# EAGLE design T03_MotionControledLampNFET (EAGLE 7.4.0)
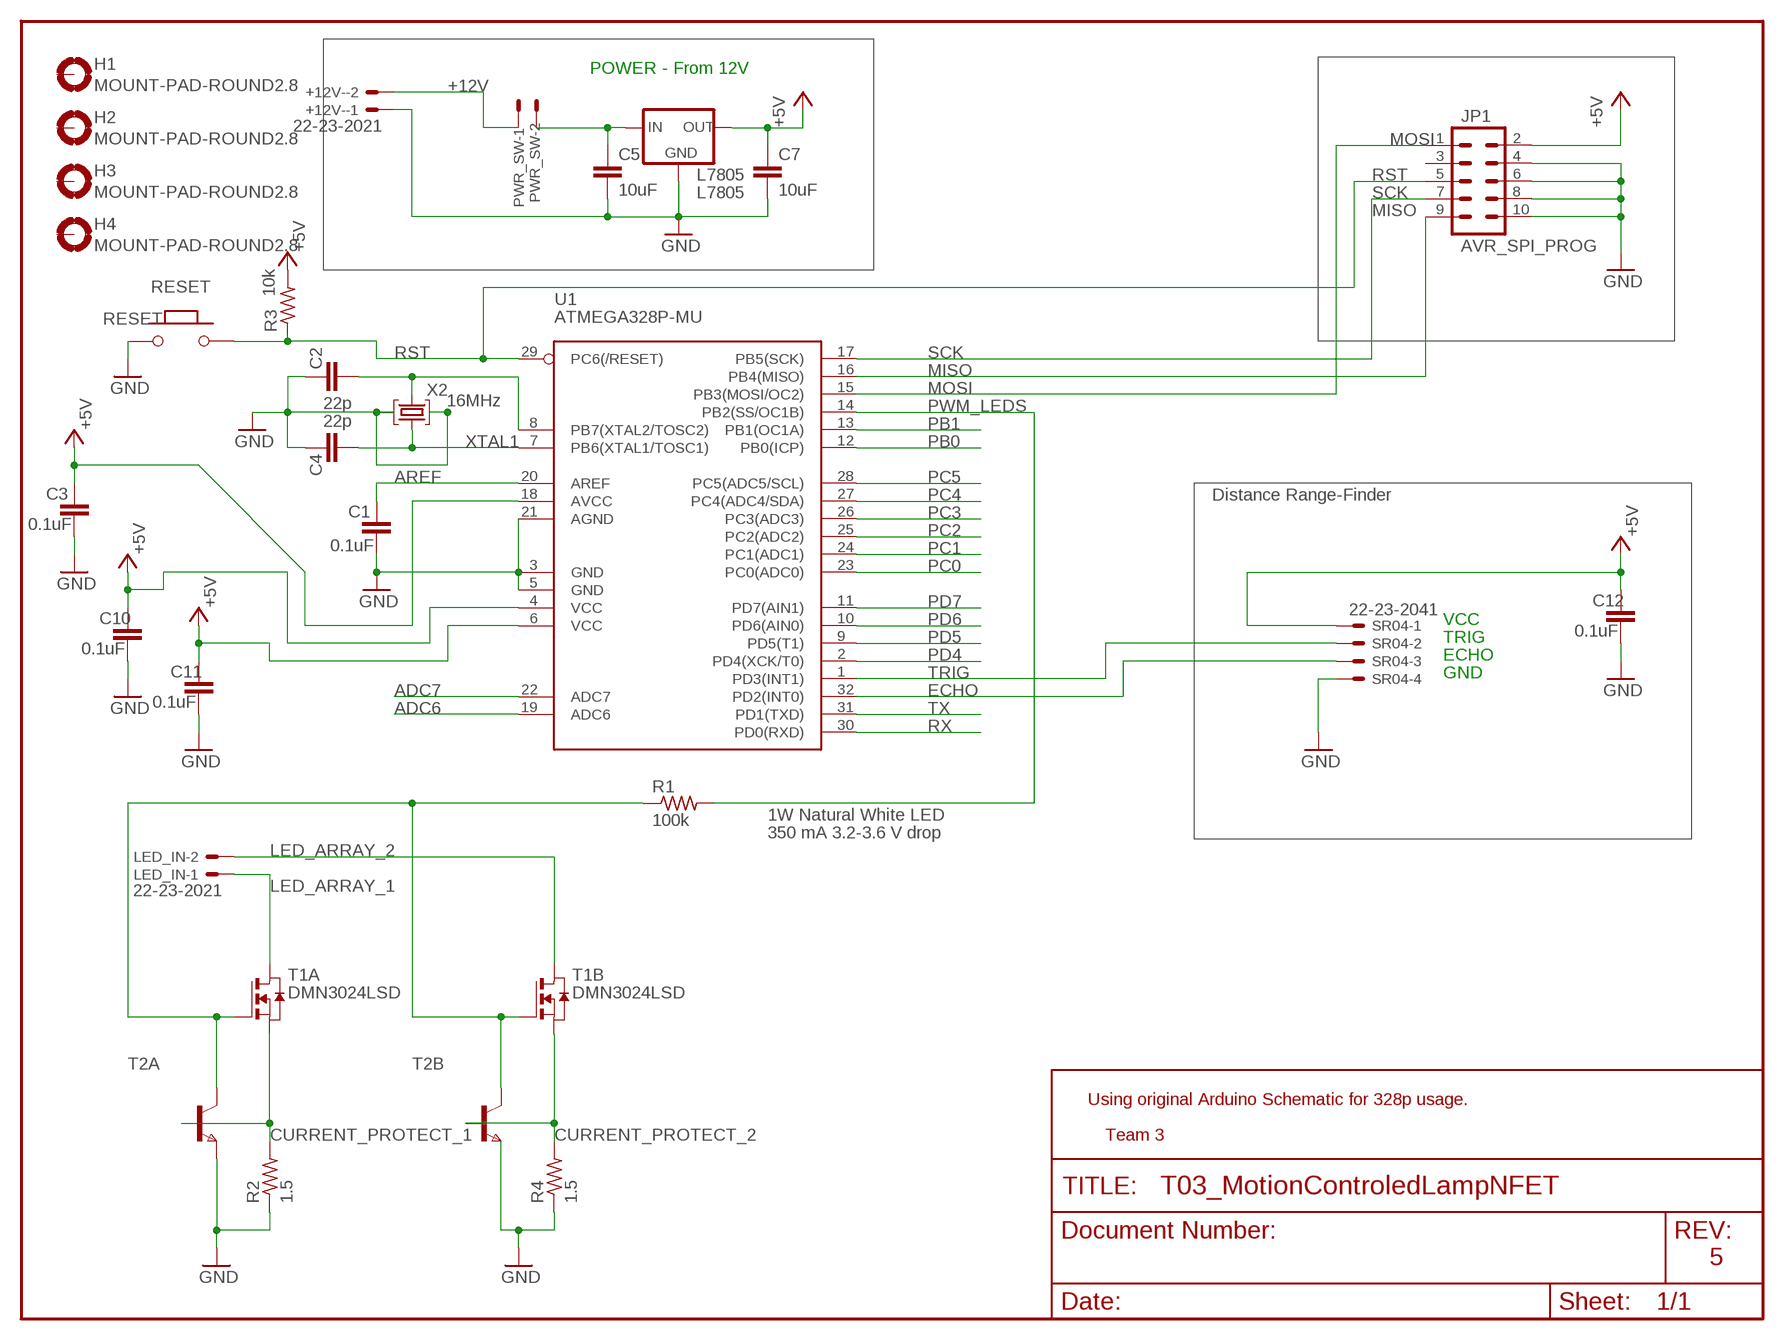
[diagram p0: schematic, sheet 1]

## Parts
+12V-  22-23-2021  [22-23-2021]
C1  0.1uF  C-EUC0603  [C0603-ROUND]
C2  22p  C-EUC0603  [C0603-ROUND]
C3  0.1uF  C-EUC0603  [C0603-ROUND]
C4  22p  C-EUC0603  [C0603-ROUND]
C5  10uF  C-EUC1206  [C1206]
C7  10uF  C-EUC1206  [C1206]
C10  0.1uF  C-EUC0603  [C0603-ROUND]
C11  0.1uF  C-EUC0603  [C0603-ROUND]
C12  0.1uF  C-EUC0603  [C0603-ROUND]
H1  MOUNT-PAD-ROUND2.8  [2,8-PAD]
H2  MOUNT-PAD-ROUND2.8  [2,8-PAD]
H3  MOUNT-PAD-ROUND2.8  [2,8-PAD]
H4  MOUNT-PAD-ROUND2.8  [2,8-PAD]
JP1  AVR_SPI_PROG  M05X2SHD_LOCK  [2X5-SHROUDED_LOCK]
L7805  L7805  78XXL  [78XXL]
LED_IN  22-23-2021  [22-23-2021]
PWR_SW  22-23-2021  [22-23-2021]
R1  100k  R-US_M1206  [M1206]
R2  1.5  R-US_M1206  [M1206]
R3  10k  R-US_M1206  [M1206]
R4  1.5  R-US_M1206  [M1206]
RESET  RESET  MYSMD_PB157  [SMD_157SW]
SR04  22-23-2041  [22-23-2041]
T1  DMN3024LSD  [SO8]
T2  NPNDUAL  [SM8]
U1  ATMEGA328P-MU  ATMEGAXX8-AU  [TQFP32-08]
X2  16MHz  CRYSTAL-3.2-2.5  [CRYSTAL-3.2-2.5]

## Nets
+5V: C3.2 C7.1 C10.2 C11.2 C12.2 JP1.2 L7805.OUT R3.2 SR04.1 U1.4(VCC) U1.6(VCC) U1.18(AVCC)
+12V: +12V-.2 PWR_SW.1
ADC6: U1.19(ADC6)
ADC7: U1.22(ADC7)
AREF: C1.2 U1.20(AREF)
CURRENT_PROTECT_1: R2.2 T1.1(A:S) T2.4(A:B)
CURRENT_PROTECT_2: R4.2 T1.3(B:S) T2.2(B:B)
ECHO: SR04.3 U1.32(PD2(INT0))
GND: +12V-.1 C1.1 C2.2 C3.1 C4.2 C5.2 C7.2 C10.1 C11.1 C12.1 JP1.4 JP1.6 JP1.8 JP1.10 L7805.GND R2.1 R4.1 RESET.1 SR04.4 T2.3(A:E) U1.3(GND) U1.5(GND) U1.21(AGND) X2.2(GND) X2.4(GND)
LED_ARRAY_1: LED_IN.1 T1.7(A:D) T1.8(A:D)
LED_ARRAY_2: LED_IN.2 T1.5(B:D) T1.6(B:D)
MISO: JP1.9 U1.16(PB4(MISO))
MOSI: JP1.1 U1.15(PB3(MOSI/OC2))
N$4: C5.1 L7805.IN PWR_SW.2
PB0: U1.12(PB0(ICP))
PB1: U1.13(PB1(OC1A))
PC0: U1.23(PC0(ADC0))
PC1: U1.24(PC1(ADC1))
PC2: U1.25(PC2(ADC2))
PC3: U1.26(PC3(ADC3))
PC4: U1.27(PC4(ADC4/SDA))
PC5: U1.28(PC5(ADC5/SCL))
PD4: U1.2(PD4(XCK/T0))
PD5: U1.9(PD5(T1))
PD6: U1.10(PD6(AIN0))
PD7: U1.11(PD7(AIN1))
PWM_CTRL_FROM_MC: R1.1 T1.2(A:G) T1.4(B:G) T2.5(A:C) T2.6(A:C) T2.7(B:C) T2.8(B:C)
PWM_LEDS: R1.2 U1.14(PB2(SS/OC1B))
RST: JP1.5 R3.1 RESET.2 U1.29(PC6(/RESET))
RX: U1.30(PD0(RXD))
SCK: JP1.7 U1.17(PB5(SCK))
TRIG: SR04.2 U1.1(PD3(INT1))
TX: U1.31(PD1(TXD))
XTAL1: C4.1 U1.7(PB6(XTAL1/TOSC1)) X2.1(C1)
XTAL2: C2.1 U1.8(PB7(XTAL2/TOSC2)) X2.3(C2)
Unconnected: H1.B2,8(MOUNT) H2.B2,8(MOUNT) H3.B2,8(MOUNT) H4.B2,8(MOUNT) JP1.3 T2.1(B:E)

## Notes on the sheet
- POWER - From 12V
- MOSI
- RST
- SCK
- MISO
- Distance Range-Finder
- VCC
- TRIG
- ECHO
- GND
- 1W Natural White LED
- 350 mA 3.2-3.6 V drop
- Using original Arduino Schematic for 328p usage.
- Team 3
- 5

## Library data of the parts
+12V- LED_IN PWR_SW = con-molex:22-23-2021: .100" (2.54mm) Center Header - 2 Pin; MF: MOLEX; MPN: 22-23-2021; OC_FARNELL: 1462926; OC_NEWARK: 25C3832
C1-C4 C10-C12 = Smartprj:C-EU: CAPACITOR, European symbol
C5 C7 = rcl:C-EU: CAPACITOR, European symbol
H1-H4 = holes:MOUNT-PAD-ROUND: MOUNTING PAD, round
JP1 = SparkFun-Connectors:M05X2: Header 5x2 Standard 10-pin dual row 0.1" header. Commonly used with AVR-ISP. Use with Spark Fun Electronics SKU: PRT-00778
L7805 = v-reg:78XXL: VOLTAGE REGULATOR
R1-R4 = rcl:R-US_: RESISTOR, American symbol
RESET = Smartprj:MYSMD_PB157
SR04 = con-molex:22-23-2041: .100" (2.54mm) Center Header - 4 Pin; MF: MOLEX; MPN: 22-23-2041; OC_FARNELL: 1462920; OC_NEWARK: 38C0355
T1 = zetex:DMN3024LSD: 30V DUAL N-CHANNEL ENHANCEMENT MODE MOSFET Source: Data sheet <http://www.diodes.com/datasheets/DMN3024LSD.pdf>; OC_FARNELL: unknown; OC_NEWARK: unknown
T2 = zetex:NPNDUAL: Dual NPN TRANSISTOR; OC_FARNELL: unknown; OC_NEWARK: unknown
U1 = Smartprj:ATMEGAXX8: MICROCONTROLLER 8 Kbytes FLASH 1 kbytes SRAM 512 bytes EEPROM USART 6-channel 10 bit ADC 2-channel 8 bit ADC Source: avr.lbr
X2 = Smartprj:CRYSTAL-3.2-2.5

## Net classes
0 default: width 0.203 mm
1 vcc: width 0.254 mm

## Board
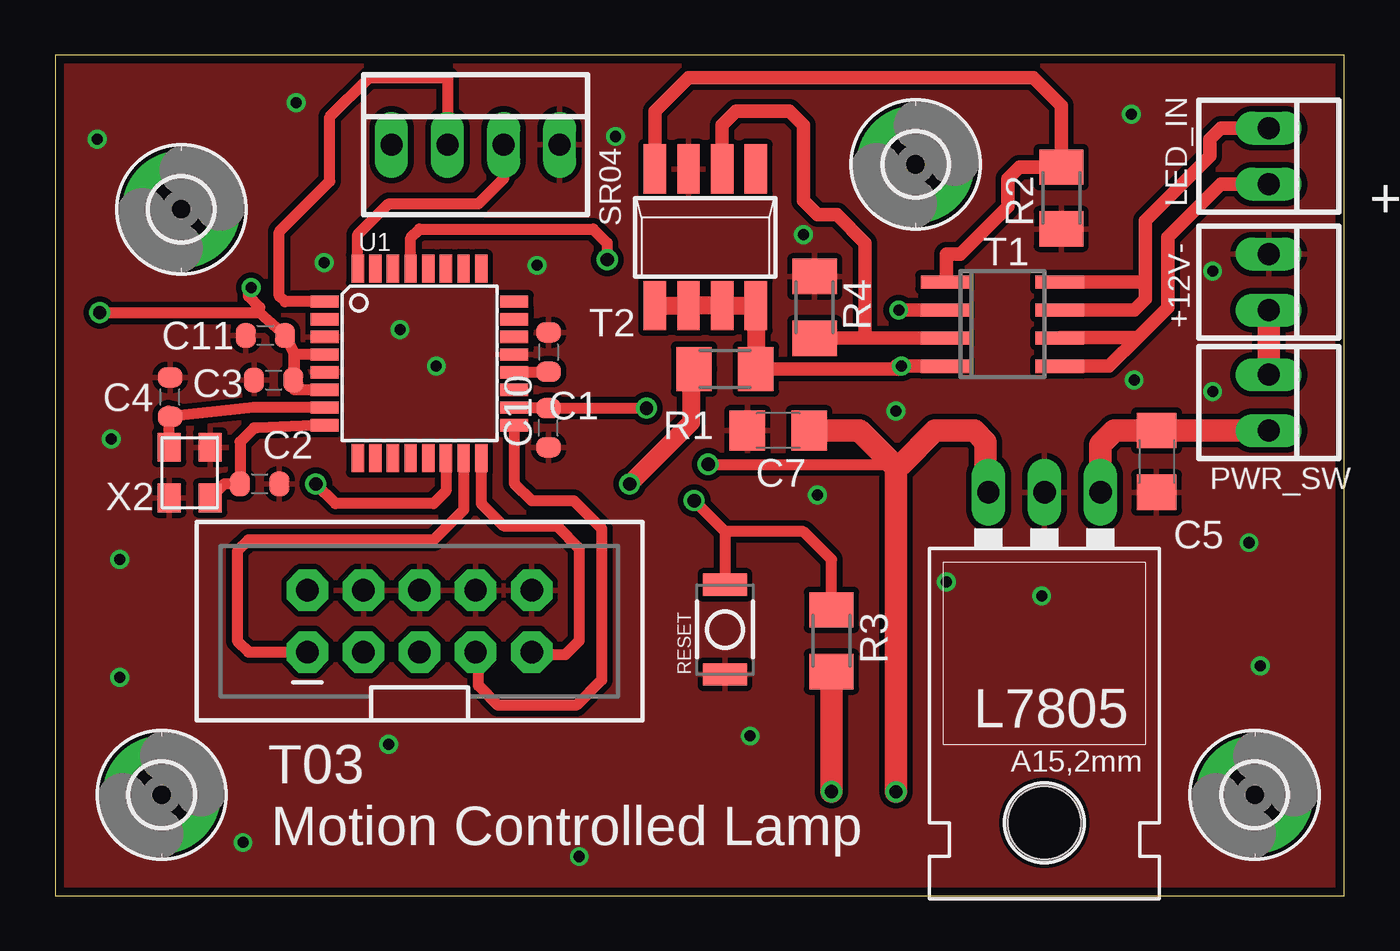
[diagram p1: board, top side]
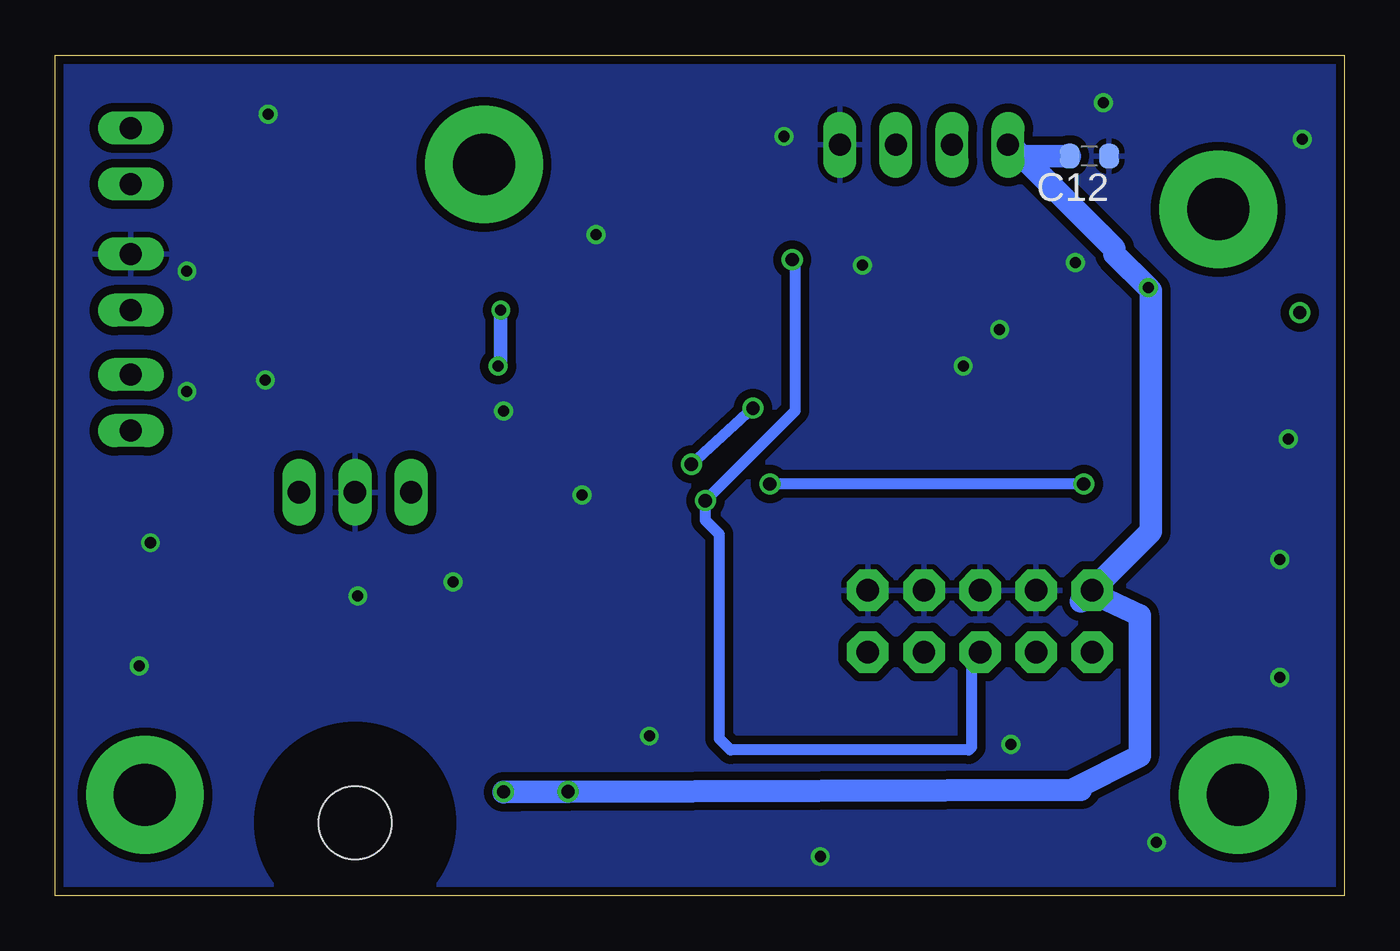
[diagram p2: board, bottom side, seen from below]

Size 58.42 x 38.1 mm. Coordinates in mm from the lower left corner, seen from the top.
Outline: 0,0 58.42,0 58.42,38.1 0,38.1 0,0
Copper layers (1*16): Top 0.0356mm / dielectric 1.5011mm / Bottom 0.0356mm
Design rules "OSH-Park-2-layer": minimum track width 6mil, minimum drill 13mil, track to track 6mil, track to pad 6mil, pad to pad 6mil, via to via 6mil, smd to smd 6mil, copper to edge 15mil, drill to drill 6mil, minimum pad ring 7mil, minimum via ring 7mil, stop-mask expansion 3mil, vias tented up to drill 0mil, thermal gap 10mil

### Footprints (pad centres in the part's own frame; a part is rotated, then mirrored left to right if it is on the bottom)
22-23-2021 = drill 1 long: 1 -1.27,0; 2 1.27,0
C0603-ROUND = smd 0.898 x 1.1: 1 -0.889,0; 2 0.889,0
C1206 = smd 1.6 x 1.8: 1 -1.4,0; 2 1.4,0
2,8-PAD = drill 2.8 pad 5.334: B2,8 0,0
2X5-SHROUDED_LOCK = drill 1.016 pad 1.88 octagon: 1 -1.397,5.08; 2 1.397,5.08; 3 -1.397,2.54; 4 1.397,2.54; 5 -1.397,0; 6 1.397,0; 7 -1.397,-2.54; 8 1.397,-2.54; 9 -1.397,-5.08; 10 1.397,-5.08
78XXL = drill 1.016 long: GND 0,-3.81; IN -2.54,-3.81; OUT 2.54,-3.81 | hole 3.302: 0,11.176
M1206 = smd 1.6 x 2: 1 -1.4,0; 2 1.4,0
SMD_157SW = smd 1.016 x 1.981: 1 -2.032,0; 2 2.032,0
22-23-2041 = drill 1 long: 1 -3.81,0; 2 -1.27,0; 3 1.27,0; 4 3.81,0
SO8 = smd 0.6 x 2.2: 1 -1.905,-2.6; 2 -0.635,-2.6; 3 0.635,-2.6; 4 1.905,-2.6; 5 1.905,2.6; 6 0.635,2.6; 7 -0.635,2.6; 8 -1.905,2.6
SM8 = smd 1.016 x 2.235: 1 -2.286,-3.099; 2 -0.762,-3.099; 3 0.762,-3.099; 4 2.286,-3.099; 5 2.286,3.099; 6 0.762,3.099; 7 -0.762,3.099; 8 -2.286,3.099
TQFP32-08 = smd 1.27 x 0.559: 1 -4.293,2.8; 2 -4.293,2; 3 -4.293,1.2; 4 -4.293,0.4; 5 -4.293,-0.4; 6 -4.293,-1.2; 7 -4.293,-2; 8 -4.293,-2.8; 17 4.293,-2.8; 18 4.293,-2; 19 4.293,-1.2; 20 4.293,-0.4; 21 4.293,0.4; 22 4.293,1.2; 23 4.293,2; 24 4.293,2.8 | smd 0.559 x 1.27: 9 -2.8,-4.293; 10 -2,-4.293; 11 -1.2,-4.293; 12 -0.4,-4.293; 13 0.4,-4.293; 14 1.2,-4.293; 15 2,-4.293; 16 2.8,-4.293; 25 2.8,4.293; 26 2,4.293; 27 1.2,4.293; 28 0.4,4.293; 29 -0.4,4.293; 30 -1.2,4.293; 31 -2,4.293; 32 -2.8,4.293
CRYSTAL-3.2-2.5 = smd 1.3 x 1.05: 1 -1.15,-0.925; 2 1.15,-0.925; 3 1.15,0.925; 4 -1.15,0.925

### Placement (x,y rotation side)
+12V-  54.99,27.81 270 top
C1  22.35,24.64 270 top
C2  9.27,18.67 0 top
C3  9.91,23.37 0 top
C4  5.21,22.61 90 top
C5  49.91,19.68 270 top
C7  32.77,21.08 180 top
C10  22.35,21.21 90 top
C11  9.53,25.4 0 top
C12  11.56,33.53 180 bottom
H1  4.83,4.57 0 top
H2  54.36,4.57 0 top
H3  38.99,33.15 0 top
H4  5.71,31.11 0 top
JP1  16.51,12.45 90 top
L7805  44.83,14.48 180 top
LED_IN  54.99,33.53 270 top
PWR_SW  54.99,22.35 270 top
R1  30.35,23.88 180 top
R2  45.59,31.62 90 top
R3  35.18,11.56 270 top
R4  34.42,26.67 270 top
RESET  30.35,12.06 90 top
SR04  19.05,34.04 0 top
T1  42.93,25.91 270 top
T2  29.46,29.84 180 top
U1  16.51,24.13 0 top
X2  6.1,19.18 270 top

### Tracks (layer width: path | path; a pad name or v marks a point on that pad's centre or on a via)
+5V  (via drill 0.5 pad 0.3, 0.6)
  Top 0.508: U1.4 10.81,24.53 C3.2 10.85,24.58 | U1.6 10.85,22.93 10.85,24.58 | 9.27,26.42 C11.2 10.85,24.58 | U1.18 22.32,22.13 arc-90 C10.2 v26.8,22.1 | v29.59,19.56 37.85,19.56 arc90 37.91,19.62 | 9.27,26.42 2.03,26.42 v2.02,26.43 | 9.27,26.42 9.27,26.67 8.76,27.18 8.76,27.43 v8.89,27.56
  Top 1.016: R3.2 | R3.2 v35.18,4.72 | 38.1,19.43 38.1,19.56 38.35,19.56 39.88,21.08 41.66,21.08 42.16,20.57 42.16,18.41 L7805.OUT | 38.1,19.43 v38.1,4.71 | C7.1 36.45,21.08 37.91,19.62 38.1,19.43
  Bottom 0.254: 11.43,5.31 11.94,4.8
  Bottom 0.406: v38.1,4.71
  Bottom 0.508: v26.8,22.1 v29.59,19.56 | 2.03,26.42 v2.02,26.43
  Bottom 1.016: 11.94,4.8 12.32,4.8 | 12.32,4.8 v35.18,4.72 | v35.18,4.72 35.69,4.72 | 35.69,4.72 37.34,4.71 | 37.34,4.71 v38.1,4.71 | v35.18,4.72 35.69,4.72 | v38.1,4.71 v38.11,4.7 | v38.1,4.71 37.34,4.71 | SR04.1 15.11,34.04 14.61,33.53 | 14.61,33.53 10.41,29.34 10.41,29.08 v8.89,27.56 8.76,27.43 8.76,16.51 JP1.2 11.94,13.34 11.43,13.72 9.27,12.7 9.27,6.35 12.32,4.8 | C12.2 14.61,33.53
+12V
  Top 1.016: PWR_SW.1 +12V-.2
AREF
  Top 0.508: U1.20 22.33,23.73 arc90 C1.2
CURRENT_PROTECT_1
  Top 0.61: T2.4 27.18,35.56 28.7,37.08 44.32,37.08 45.59,35.81 R2.2 43.69,33.02 43.18,32.51 43.18,31.24 41.02,29.08 40.39,29.08 40.39,27.87 T1.1
CURRENT_PROTECT_2
  Top 0.61: T1.3 36.7,25.27 | 36.7,25.27 R4.2 | T2.2 30.23,34.92 30.86,35.56 33.27,35.56 33.91,34.92 33.91,31.5 34.54,30.86 35.43,30.86 36.7,29.59 36.7,25.27
ECHO
  Top 0.508: U1.32 13.72,29.97 15.11,31.37 19.18,31.37 20.32,32.51 SR04.3
GND  (via drill 0.5)
  other vias: 2.54,20.7 54.61,10.41 40.39,14.22 15.62,25.65 12.19,28.7 52.45,28.32 10.92,35.94 1.91,34.29 2.92,15.24 8.51,2.41 25.4,34.42 33.91,29.97 38.1,21.97 48.77,35.43 54.1,16 31.5,7.24 15.11,6.86 34.54,18.16 48.9,23.37 52.45,22.86 2.92,9.91 21.84,28.57 17.27,24 23.75,1.78 44.7,13.59
  pour Top (isolate 0.254): 0,0 58.42,0 58.42,38.1 0,38.1
  pour Bottom (isolate 0.381): 0,0 58.42,0 58.42,38.1 0,38.1
LED_ARRAY_1
  Top 0.61: T1.7 48.9,26.54 49.4,27.05 49.4,27.81 | 49.4,27.81 49.4,30.61 52.32,33.53 52.32,34.29 52.83,34.8 LED_IN.1 | T1.8 49.4,27.81
LED_ARRAY_2
  Top 0.61: T1.5 47.75,24 49.05,25.31 | 49.05,25.31 50.42,26.67 50.42,29.84 52.83,32.26 LED_IN.2 | T1.6 45.56,25.31 49.05,25.31
MISO
  Top 0.508: U1.16 arc90 U1.16 19.3,17.78 20.32,16.76 22.73,16.76 23.75,15.75 23.75,11.56 23.11,10.92 21.72,10.92 JP1.9
MOSI
  Top 0.508: JP1.1 8.76,11.05 8.26,11.56 8.26,15.62 8.76,16.13 17.14,16.13 18.51,17.49 U1.15
N$4
  Top 1.016: L7805.IN 47.37,20.45 48.01,21.09 C5.1 PWR_SW.2
PWM_CTRL_FROM_MC  (via drill 0.5 pad 0.3)
  Top 0.61: T1.4 v38.35,24 | v38.35,24 38.1,24 37.97,23.88 38.35,23.88 v38.35,24 | T1.2 v38.23,26.54 | R1.1 38.23,23.88 v38.35,24
  Top 0.813: T2.5 T2.6 T2.7 T2.8 R1.1
  Bottom 0.61: v38.23,26.54 38.23,24 v38.35,24
PWM_LEDS  (via drill 0.6)
  Top 0.508: v11.81,18.67 12.7,17.78 17.14,17.78 17.71,18.34 U1.14
  Top 0.813: 29.34,23.88 R1.2 28.83,23.75 28.83,21.46 v26.04,18.67
  Bottom 0.508: v11.81,18.67 v26.04,18.67
RST  (via drill 0.6)
  Top 0.508: v25.02,28.83 25.02,29.59 24.38,30.23 16.51,30.23 16.11,29.83 U1.29 | v28.96,17.91 30.35,16.51 | 30.35,16.51 RESET.2 | R3.1 35.18,15.24 33.91,16.51 30.35,16.51
  Bottom 0.508: v25.02,28.83 24.89,28.7 24.89,21.97 v28.96,17.91 28.96,17.02 28.32,16.38 28.32,7.11 27.81,6.6 17.02,6.6 16.89,6.73 16.89,10.67 JP1.5
SCK
  Top 0.508: U1.17 20.8,18.69 21.59,17.91 23.5,17.91 24.77,16.64 24.77,9.78 23.62,8.64 20.07,8.64 19.18,9.53 19.18,10.92 JP1.7
TRIG
  Top 0.508: U1.1 10.41,26.92 10.16,27.18 10.16,30.1 12.45,32.38 12.45,35.31 14.22,37.08 17.78,37.08 SR04.2
XTAL1
  Top 0.508: U1.7 8.98,22.13 C4.1 5.12,21.97 X2.1
XTAL2
  Top 0.508: U1.8 9.14,21.2 9.01,21.2 8.38,20.57 C2.1 7.66,18.67 X2.3

### Text on the board
tPlace: T03 | Motion Controlled Lamp
tNames: +